# EAGLE design ADC Board-NC (EAGLE 6.4)

## Sheet 1 of 5: Power
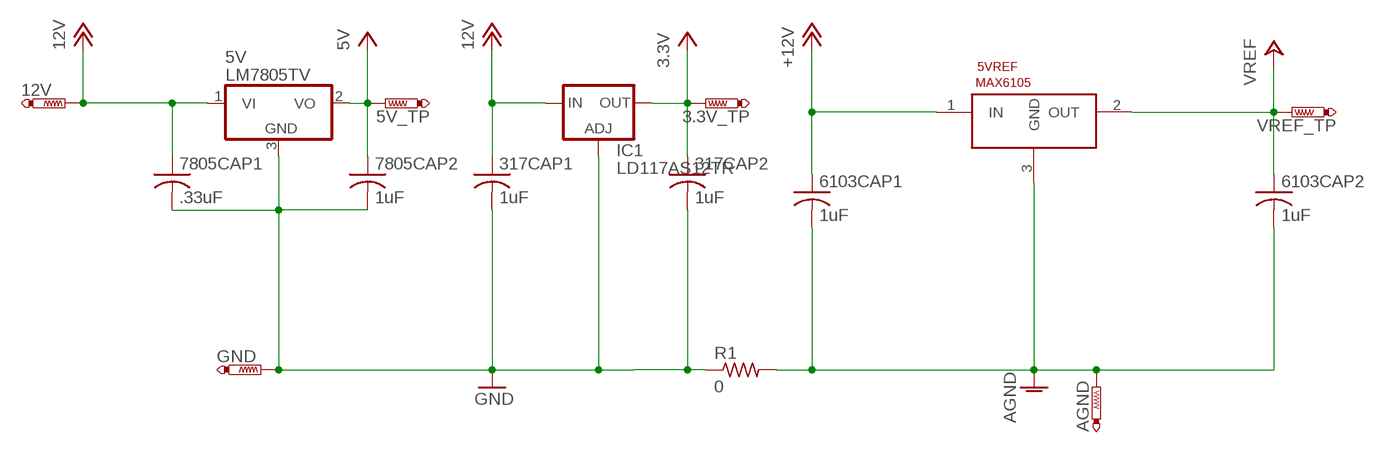
[diagram p0: schematic, sheet 1]

### Parts
3.3V_TP  TESTPAD-20MIL  [20MIL]
5V  LM7805TV  7805DT  [TO252]
5V_TP  TESTPAD-20MIL  [20MIL]
5VREF  MAX6105  MAX6103  [SOT23]
12V  TESTPAD-20MIL  [20MIL]
317CAP1  1uF  C-USC1206  [C1206]
317CAP2  1uF  C-USC1206  [C1206]
6103CAP1  1uF  C-USC1206  [C1206]
6103CAP2  1uF  C-USC1206  [C1206]
7805CAP1  .33uF  C-USC1206  [C1206]
7805CAP2  1uF  C-USC1206  [C1206]
AGND  TESTPAD-20MIL  [20MIL]
GND  TESTPAD-20MIL  [20MIL]
IC1  LD117AS12TR  [SOT223]
R1  0  R-US_R1206  [R1206]
VREF_TP  TESTPAD-20MIL  [20MIL]

### Nets
3.3V: 3.3V_TP.P$1(TP) 317CAP2.1 IC1.4(OUT)
5V: 5V.2(VO) 5V_TP.P$1(TP) 7805CAP2.1 ; also sheet 2
12V: 5V.1(VI) 5VREF.1(IN) 12V.P$1(TP) 317CAP1.1 6103CAP1.1 7805CAP1.1 IC1.3(IN) ; supply symbol labelled +12V ; also sheet 3,5
AGND: 5VREF.3(GND) 6103CAP1.2 6103CAP2.2 AGND.P$1(TP) R1.2 ; also sheet 2,3,4,5
GND: 5V.3(GND) 317CAP1.2 317CAP2.2 7805CAP1.2 7805CAP2.2 GND.P$1(TP) IC1.1(ADJ) R1.1 ; also sheet 2,5
VREF: 5VREF.2(OUT) 6103CAP2.1 VREF_TP.P$1(TP) ; supply symbol labelled Vref ; also sheet 2,4,5

## Sheet 2 of 5: ADCs
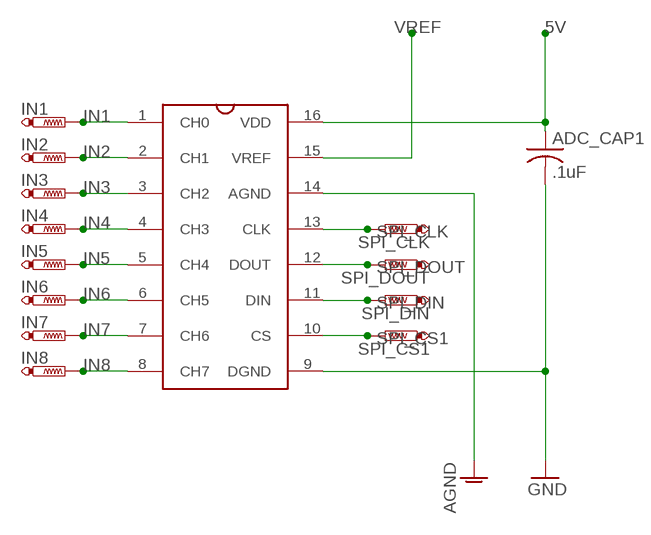
[diagram p1: schematic, sheet 2]

### Parts
ADC1  MCP-3008  [SO16]
ADC_CAP1  .1uF  C-USC1206  [C1206]
IN1  TESTPAD-20MIL  [20MIL]
IN2  TESTPAD-20MIL  [20MIL]
IN3  TESTPAD-20MIL  [20MIL]
IN4  TESTPAD-20MIL  [20MIL]
IN5  TESTPAD-20MIL  [20MIL]
IN6  TESTPAD-20MIL  [20MIL]
IN7  TESTPAD-20MIL  [20MIL]
IN8  TESTPAD-20MIL  [20MIL]
SPI_CLK  TESTPAD-20MIL  [20MIL]
SPI_CS1  TESTPAD-20MIL  [20MIL]
SPI_DIN  TESTPAD-20MIL  [20MIL]
SPI_DOUT  TESTPAD-20MIL  [20MIL]

### Nets
5V: ADC1.16(VDD) ADC_CAP1.1 ; also sheet 1
AGND: ADC1.14(AGND) ; also sheet 1,3,4,5
GND: ADC1.9(DGND) ADC_CAP1.2 ; also sheet 1,5
IN1: ADC1.1(CH0) IN1.P$1(TP) ; also sheet 4,5
IN2: ADC1.2(CH1) IN2.P$1(TP) ; also sheet 4,5
IN3: ADC1.3(CH2) IN3.P$1(TP) ; also sheet 4,5
IN4: ADC1.4(CH3) IN4.P$1(TP) ; also sheet 4,5
IN5: ADC1.5(CH4) IN5.P$1(TP) ; also sheet 4,5
IN6: ADC1.6(CH5) IN6.P$1(TP) ; also sheet 4,5
IN7: ADC1.7(CH6) IN7.P$1(TP) ; also sheet 4,5
IN8: ADC1.8(CH7) IN8.P$1(TP) ; also sheet 3,4
SPI_CLK: ADC1.13(CLK) SPI_CLK.P$1(TP) ; also sheet 5
SPI_CS1: ADC1.10(CS) SPI_CS1.P$1(TP) ; also sheet 5
SPI_DIN: ADC1.11(DIN) SPI_DIN.P$1(TP) ; also sheet 5
SPI_DOUT: ADC1.12(DOUT) SPI_DOUT.P$1(TP) ; also sheet 5
VREF: ADC1.15(VREF) ; also sheet 1,4,5

## Sheet 3 of 5: Temp Sensor
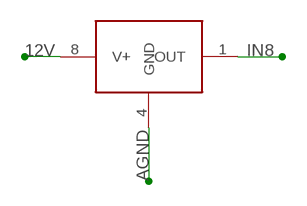
[diagram p2: schematic, sheet 3]

### Parts
U$2  LM35  [SO-08]

### Nets
12V: U$2.8(V+) ; also sheet 1,5
AGND: U$2.4(GND) ; also sheet 1,2,4,5
IN8: U$2.1(OUT) ; also sheet 2,4

## Sheet 4 of 5: Input Protection
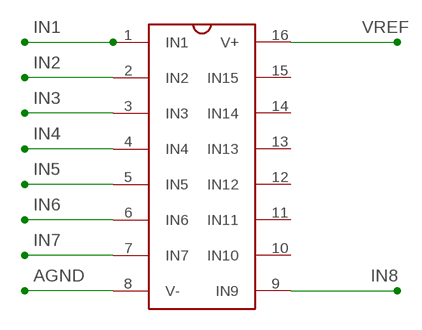
[diagram p3: schematic, sheet 4]

### Parts
U$6  SP720APP  [SO16]

### Nets
AGND: U$6.8(V-) ; also sheet 1,2,3,5
IN1: U$6.1(IN1) ; also sheet 2,5
IN2: U$6.2(IN2) ; also sheet 2,5
IN3: U$6.3(IN3) ; also sheet 2,5
IN4: U$6.4(IN4) ; also sheet 2,5
IN5: U$6.5(IN5) ; also sheet 2,5
IN6: U$6.6(IN6) ; also sheet 2,5
IN7: U$6.7(IN7) ; also sheet 2,5
IN8: U$6.9(IN9) ; also sheet 2,3
VREF: U$6.16(V+) ; also sheet 1,2,5
Unconnected: U$6.10(IN10) U$6.11(IN11) U$6.12(IN12) U$6.13(IN13) U$6.14(IN14) U$6.15(IN15)

## Sheet 5 of 5: Connectors
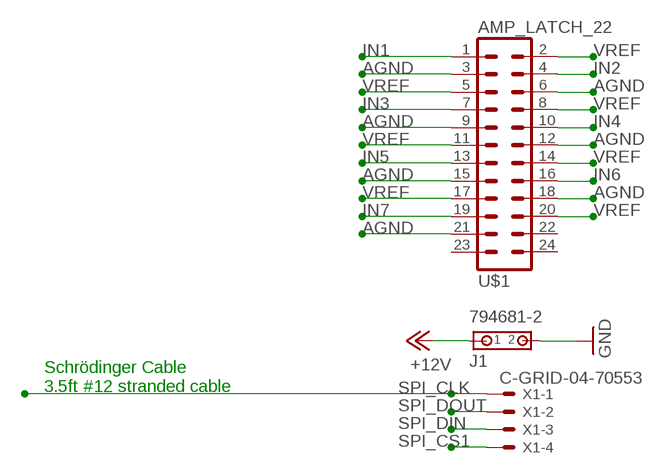
[diagram p4: schematic, sheet 5]

### Parts
J1  794681-2  [794681-2]
U$1  AMP_LATCH_22  [MA22-2]
X1  C-GRID-04-70553  [70553-04]

### Nets
12V: J1.1 ; supply symbol labelled +12V ; also sheet 1,3
AGND: U$1.3 U$1.6 U$1.9 U$1.12 U$1.15 U$1.18 U$1.21 ; also sheet 1,2,3,4
GND: J1.2 ; also sheet 1,2
IN1: U$1.1 ; also sheet 2,4
IN2: U$1.4 ; also sheet 2,4
IN3: U$1.7 ; also sheet 2,4
IN4: U$1.10 ; also sheet 2,4
IN5: U$1.13 ; also sheet 2,4
IN6: U$1.16 ; also sheet 2,4
IN7: U$1.19 ; also sheet 2,4
SPI_CLK: X1.1 ; also sheet 2
SPI_CS1: X1.4 ; also sheet 2
SPI_DIN: X1.3 ; also sheet 2
SPI_DOUT: X1.2 ; also sheet 2
VREF: U$1.2 U$1.5 U$1.8 U$1.11 U$1.14 U$1.17 U$1.20 ; also sheet 1,2,4
Unconnected: U$1.22 U$1.23 U$1.24

### Notes on the sheet
- Schrödinger Cable
  3.5ft #12 stranded cable

## Library data of the parts
3.3V_TP 5V_TP 12V AGND GND IN1-IN8 SPI_CLK SPI_CS1 SPI_DIN SPI_DOUT VREF_TP = LTC6803:TESTPAD-20MIL
5V = linear:78*: Positive VOLTAGE REGULATOR Source: http://cache.national.com/ds/LM/LM78L05.pdf http://www.fairchildsemi.com/ds/LM/LM7805.pdf
5VREF = SolarJacketsADC:MAX6103
317CAP1 317CAP2 6103CAP1 6103CAP2 7805CAP1 7805CAP2 ADC_CAP1 = rcl:C-US: CAPACITOR, American symbol
ADC1 = SolarJacketsADC:MCP-3008
IC1 = v-reg:LD117A?*: Low drop fixed and adjustable positive voltage regulators 1 A Source: http://www.st.com/stonline/products/literature/ds/7194/ld1117axx.pdf
J1 = con-amp:794681-2: Micro MATE-N-LOK Connectors grid 1.5mm Dual Row Through Hole Vertical Metal Through Hole Holddowns Source: ENG_CD_794681_E.pdf
R1 = rcl:R-US_: RESISTOR, American symbol
U$1 = SolarJackets_Common:AMP_LATCH_22
U$2 = SolarJacketsADC:LM35
U$6 = SolarJacketsADC:SP720APP
X1 = con-molex:C-GRID-04: CONNECTOR wire to board 2.54 mm (0.100") pitch header; OC_FARNELL: unknown; OC_NEWARK: unknown

## Board
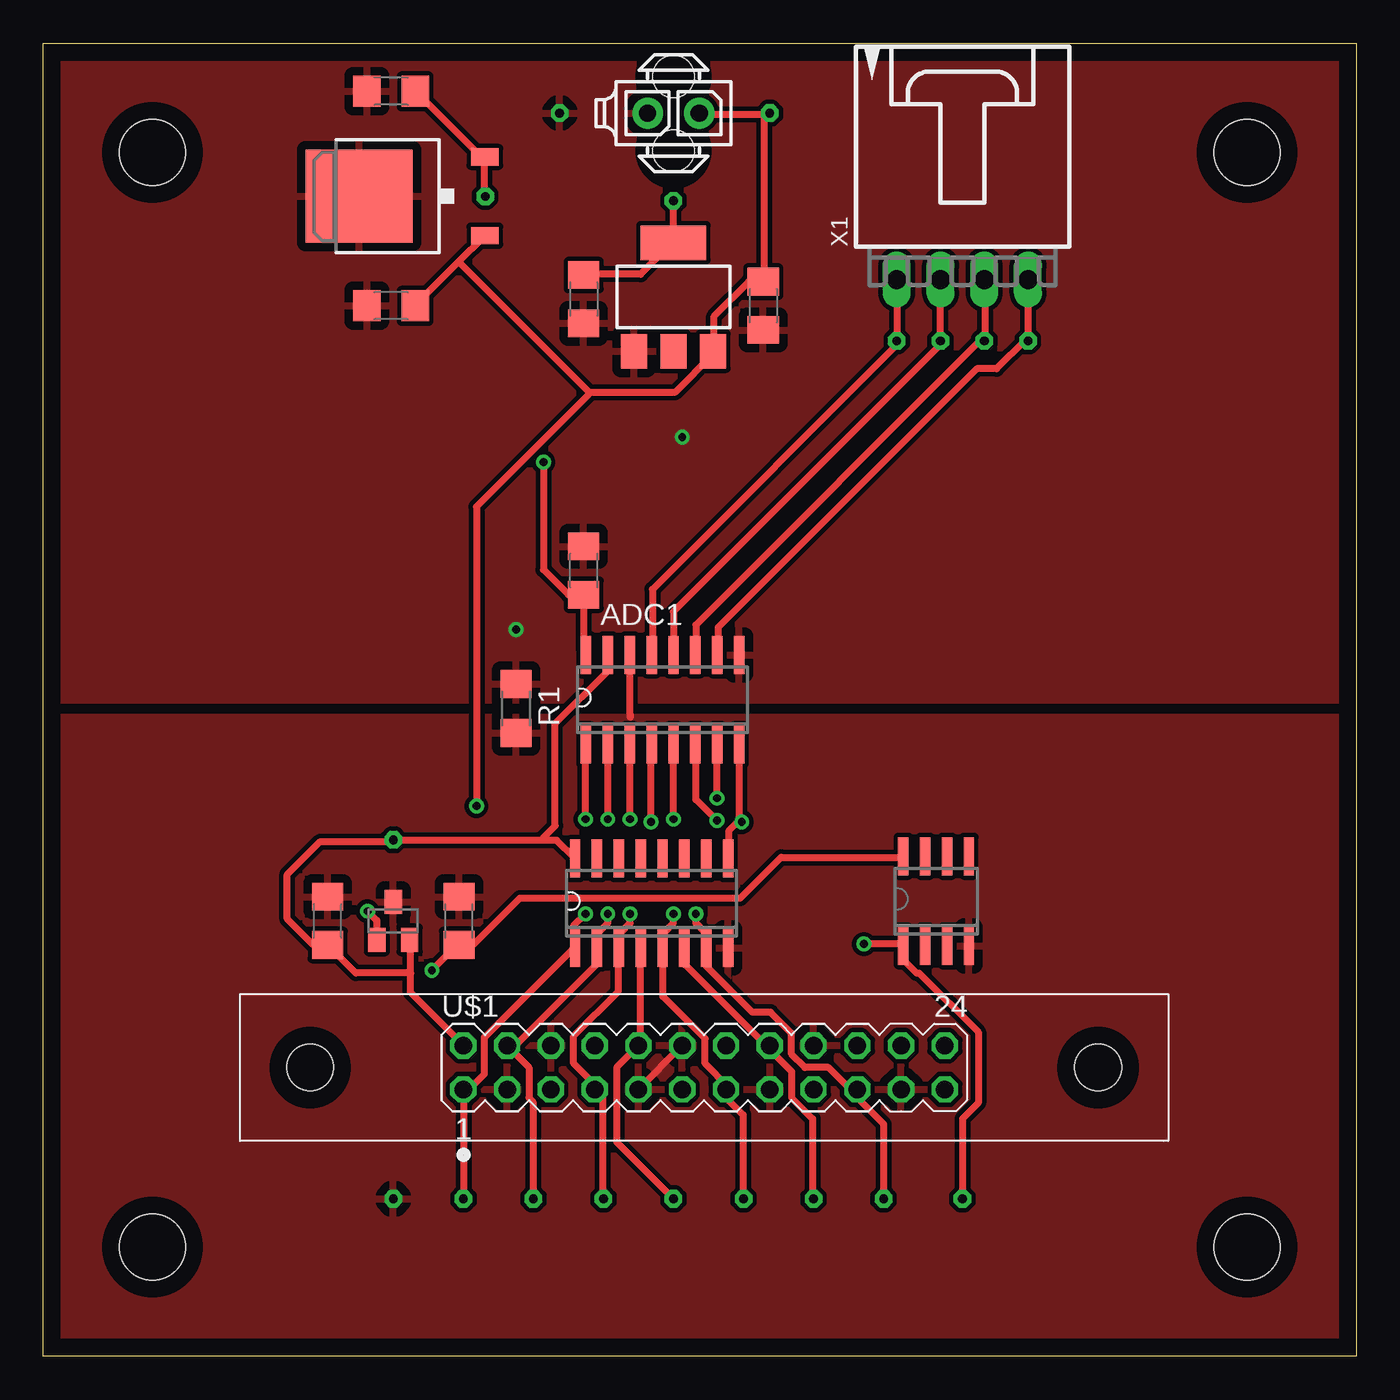
[diagram p5: board, top side]
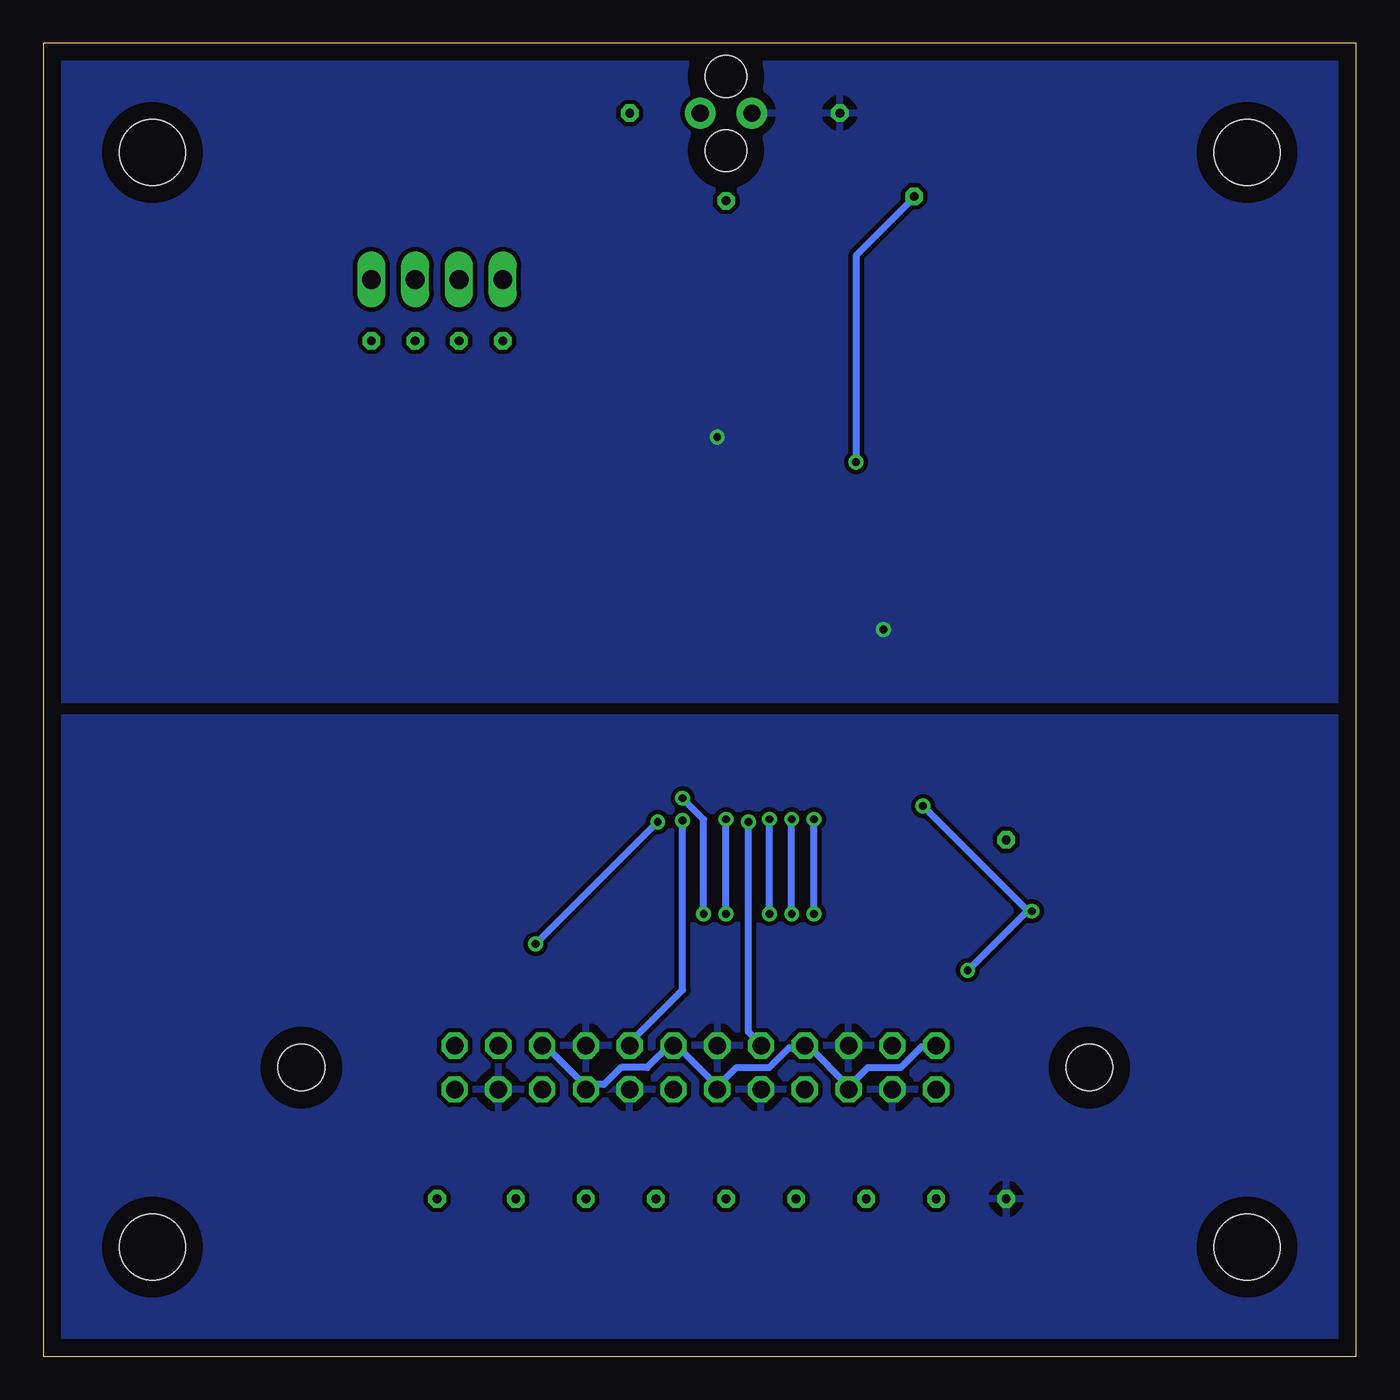
[diagram p6: board, bottom side, seen from below]

Size 76.2 x 76.2 mm. Coordinates in mm from the lower left corner, seen from the top.
Outline: 0,0 0,76.2 76.2,76.2 76.2,0 0,0
Copper layers (1*16): Top 0.035mm / dielectric 1.5mm / Bottom 0.035mm
Design rules "SJ Design Rules *": minimum track width 16mil, minimum drill 18mil, track to track 10mil, track to pad 10mil, pad to pad 10mil, via to via 10mil, smd to smd 10mil, copper to edge 40mil, drill to drill 10mil, minimum pad ring 10mil, minimum via ring 8mil, stop-mask expansion 4mil, vias tented up to drill 0mil, thermal gap 20mil
Holes 3.81 mm at 69.85,69.85 6.35,69.85 69.85,6.35 6.35,6.35

### Footprints (pad centres in the part's own frame; a part is rotated, then mirrored left to right if it is on the bottom)
20MIL = drill 0.508 octagon: P$1 0,0
TO252 = smd 1 x 1.6: 1 -2.28,-4.8; 2 2.28,-4.8 | smd 5.4 x 6.2: 3 0,2.5
SOT23 = smd 1 x 1.4: 1 -0.95,-1.1; 2 0.95,-1.1; 3 0,1.1
C1206 = smd 1.6 x 1.8: 1 -1.4,0; 2 1.4,0
SO16 = smd 0.6 x 2.2: 1 -4.445,-2.6; 2 -3.175,-2.6; 3 -1.905,-2.6; 4 -0.635,-2.6; 5 0.635,-2.6; 6 1.905,-2.6; 7 3.175,-2.6; 8 4.445,-2.6; 9 4.445,2.6; 10 3.175,2.6; 11 1.905,2.6; 12 0.635,2.6; 13 -0.635,2.6; 14 -1.905,2.6; 15 -3.175,2.6; 16 -4.445,2.6
SOT223 = smd 1.5 x 2: 1 -2.3,-3.15; 2 0,-3.15; 3 2.3,-3.15 | smd 3.8 x 2: 4 0,3.15
794681-2 = drill 1 pad 1.778: 1 0,-1.5; 2 0,1.5 | hole 2.4: 2.13,0; -2.17,0
R1206 = smd 1.6 x 1.803: 1 -1.422,0; 2 1.422,0
MA22-2 = drill 1.016 octagon: 1 -11.43,-1.27; 2 -11.43,1.27; 3 -8.89,-1.27; 4 -8.89,1.27; 5 -6.35,-1.27; 6 -6.35,1.27; 7 -3.81,-1.27; 8 -3.81,1.27; 9 -1.27,-1.27; 10 -1.27,1.27; 11 1.27,-1.27; 12 1.27,1.27; 13 3.81,-1.27; 14 3.81,1.27; 15 6.35,-1.27; 16 6.35,1.27; 17 8.89,-1.27; 18 8.89,1.27; 19 11.43,-1.27; 20 11.43,1.27; 21 13.97,-1.27; 22 13.97,1.27; 23 16.51,-1.27; 24 16.51,1.27 | hole 2.692: -20.32,0; 25.4,0
SO-08 = smd 0.6 x 2.2: 1 -1.905,-2.6; 2 -0.635,-2.6; 3 0.635,-2.6; 4 1.905,-2.6; 5 1.905,2.6; 6 0.635,2.6; 7 -0.635,2.6; 8 -1.905,2.6
70553-04 = drill 1.092 long: 1 -3.81,-7.62; 2 -1.27,-7.62; 3 1.27,-7.62; 4 3.81,-7.62

### Placement (x,y rotation side)
3.3V_TP  36.58,67.06 0 top
5V  20.83,67.31 90 top
5V_TP  25.65,67.31 0 top
5VREF  20.32,25.27 0 top
12V  42.16,72.14 0 top
317CAP1  41.78,60.96 270 top
317CAP2  31.37,61.34 270 top
6103CAP1  24.13,25.27 90 top
6103CAP2  16.51,25.27 90 top
7805CAP1  20.19,60.96 180 top
7805CAP2  20.19,73.41 180 top
ADC1  35.94,38.1 0 top
ADC_CAP1  31.37,45.59 90 top
AGND  20.32,9.14 0 top
GND  29.97,72.14 0 top
IC1  36.58,61.47 0 top
IN1  24.38,9.14 0 top
IN2  28.45,9.14 0 top
IN3  32.51,9.14 0 top
IN4  36.58,9.14 0 top
IN5  40.64,9.14 0 top
IN6  44.7,9.14 0 top
IN7  48.77,9.14 0 top
IN8  53.34,9.14 0 top
J1  36.58,72.14 90 top
R1  27.43,37.59 270 top
SPI_CLK  49.53,58.93 0 top
SPI_CS1  57.15,58.93 0 top
SPI_DIN  54.61,58.93 0 top
SPI_DOUT  52.07,58.93 0 top
U$1  35.81,16.76 0 top
U$2  51.82,26.42 0 top
U$6  35.31,26.29 0 top
VREF_TP  20.32,29.97 0 top
X1  53.34,70.1 0 top

### Tracks (layer width: path | path; a pad name or v marks a point on that pad's centre or on a via)
3.3V
  Top 0.406: 317CAP2.1 31.39,62.79 34.67,62.79 36.58,64.69 IC1.4 36.58,64.85 3.3V_TP.P$1
5V  (via drill 0.46)
  Top 0.406: ADC1.16 31.55,40.77 31.39,40.92 31.39,44.12 ADC_CAP1.1 31.17,44.2 30.48,44.2 29.03,45.64 v29.03,51.89 | 5V_TP.P$1 25.6,67.36 25.6,69.57 5V.2 25.45,69.57 21.64,73.38 7805CAP2.1
  Bottom 0.406: v29.03,51.89 29.03,63.86 25.6,67.28 5V_TP.P$1
12V  (via drill 0.46)
  Top 0.406: v18.82,25.83 19.36,25.3 19.36,24.23 5VREF.1 | v22.55,22.4 24.08,23.93 6103CAP1.1 24.31,23.93 24.99,23.93 27.66,26.59 40.46,26.59 42.82,28.96 49.91,28.96 U$2.8 | 24.12,63.51 21.57,60.96 7805CAP1.1 | 24.12,63.51 25.6,65 5V.1 | J1.1 38.1,72.08 42.14,72.08 12V.P$1 41.83,71.93 41.83,62.56 317CAP1.1 41.76,62.33 40.92,62.33 38.94,60.35 38.94,58.37 IC1.3 38.86,58.14 36.65,55.93 31.7,55.93 | 31.7,55.93 24.23,63.4 24.12,63.51 | v25.15,31.93 25.15,49.3 31.62,55.78 31.7,55.93
  Bottom 0.406: v22.55,22.4 19.13,25.83 v18.82,25.83 19.2,25.98 v25.15,31.93
AGND
  Top 0.406: ADC1.14 34.06,40.69 34.06,37.26 34.06,37.08 | U$1.9 U$1.12
  pour Bottom: 0.51,37.08 0.51,0.51 75.69,0.51 75.69,37.08
  pour Top: 0.51,37.08 0.51,0.51 75.69,0.51 75.69,37.08
GND  (via drill 0.46)
  other vias: 27.43,42.16 37.08,53.34
  pour Top: 0.51,75.69 0.51,38.1 75.69,38.1 75.69,75.69
  pour Bottom: 0.51,75.69 0.51,38.1 75.69,38.1 75.69,75.69
IN1  (via drill 0.46)
  Top 0.406: IN1.P$1 24.38,15.47 U$1.1 24.54,15.32 25.6,16.38 25.6,18.52 30.71,23.62 30.86,23.62 U$6.1 30.79,23.85 30.79,24.99 v31.47,25.68 | v31.47,31.17 31.47,35.43 ADC1.1
  Bottom 0.406: v31.47,25.68 v31.47,31.17
IN2  (via drill 0.46)
  Top 0.406: IN2.P$1 28.42,9.14 28.42,14.78 28.19,15.01 28.19,16.76 26.98,17.98 U$1.4 27.28,17.91 32.08,22.71 32.08,23.62 U$6.2 32.23,23.85 32.23,24.61 32.77,25.15 v32.77,25.68 | v32.77,31.17 32.77,35.43 ADC1.2
  Bottom 0.406: v32.77,25.68 v32.77,31.17
IN3  (via drill 0.46)
  Top 0.406: IN3.P$1 32.46,9.14 32.46,15.01 32,15.47 U$1.7 32.16,15.62 30.79,16.99 30.79,18.59 33.38,21.18 33.38,23.62 U$6.3 33.53,23.85 33.53,24.61 34.06,25.15 v34.06,25.68 | v34.06,31.17 34.06,35.43 ADC1.3
  Bottom 0.406: v34.06,25.68 v34.06,31.17
IN4  (via drill 0.46)
  Top 0.406: U$6.4 34.67,23.62 34.67,18.14 U$1.10 33.27,16.76 33.27,12.45 IN4.P$1 | v35.28,31.01 35.28,35.43 ADC1.4
  Bottom 0.406: v35.28,31.01 35.28,18.82 34.52,18.06 U$1.10
IN5  (via drill 0.46)
  Top 0.406: IN5.P$1 40.62,9.14 40.62,14.02 39.62,15.01 39.62,15.47 U$1.13 39.78,15.62 38.41,16.99 38.41,18.44 35.97,20.88 35.97,23.62 U$6.5 36.04,23.85 36.04,24.61 36.58,25.15 v36.58,25.68 | v36.58,31.17 36.58,35.43 ADC1.5
  Bottom 0.406: v36.58,25.68 v36.58,31.17
IN6  (via drill 0.46)
  Top 0.406: IN6.P$1 44.65,9.14 44.65,13.79 43.43,15.01 43.43,16.54 42.22,17.75 42.22,17.98 U$1.16 41.99,17.98 37.26,22.71 37.26,23.62 U$6.6 | v39.09,31.09 37.87,32.31 37.87,35.43 ADC1.6
  Bottom 0.406: v39.09,31.09 39.09,21.26 42.14,18.21 42.14,18.06 U$1.16
IN7  (via drill 0.46)
  Top 0.406: IN7.P$1 48.77,13.49 47.24,15.01 47.24,15.47 U$1.19 47.09,15.24 45.57,16.76 44.2,16.76 43.43,17.53 43.43,18.75 42.22,19.96 41.15,19.96 38.48,22.63 38.48,23.62 U$6.7 38.41,23.85 38.41,24.61 37.87,25.15 v37.87,25.68 | v39.09,32.38 39.09,35.43 ADC1.7
  Bottom 0.406: v39.09,32.38 37.87,31.17 v37.87,25.68
IN8  (via drill 0.46)
  Top 0.406: 40.39,31.09 39.78,30.48 39.78,28.96 U$6.9 | 40.39,31.09 40.39,35.43 ADC1.8 | IN8.P$1 53.34,13.79 54.25,14.71 54.25,18.82 50.83,22.25 50.67,22.25 49.91,23.01 49.91,23.77 U$2.1 49.76,23.93 v47.62,23.93 | v40.54,31.01 40.39,31.09
  Bottom 0.406: v47.62,23.93 v40.54,31.01
SPI_CLK
  Top 0.406: X1.1 49.53,58.98 SPI_CLK.P$1 49.61,58.75 35.36,44.5 35.36,40.77 ADC1.13
SPI_CS1
  Top 0.406: X1.4 57.15,58.98 SPI_CS1.P$1 57,58.98 55.32,57.3 54.18,57.3 39.17,42.29 39.17,40.77 ADC1.10
SPI_DIN
  Top 0.406: X1.3 54.63,62.48 54.63,58.98 SPI_DIN.P$1 54.48,59.05 37.87,42.44 37.87,40.77 ADC1.11
SPI_DOUT
  Top 0.406: X1.2 52.05,62.48 52.05,58.98 SPI_DOUT.P$1 52.12,58.75 36.58,43.2 36.58,40.77 ADC1.12
VREF
  Top 0.406: 29.03,29.95 29.79,29.95 U$6.16 | 29.03,29.95 20.34,29.95 VREF_TP.P$1 20.19,29.87 16.08,29.87 14.17,27.96 14.17,25.38 15.62,23.93 16.31,23.93 6103CAP2.1 16.54,23.85 18.14,22.25 21.18,22.25 21.34,22.25 | ADC1.15 32.77,39.78 29.72,36.73 29.72,30.79 29.03,30.1 29.03,29.95 | 21.34,22.25 21.34,21.11 24.38,18.06 U$1.2 | 21.34,22.25 21.34,24.16 5VREF.2
  Bottom 0.406: U$1.20 47.24,17.98 47.02,17.98 44.73,15.7 44.73,15.54 U$1.17 44.58,15.77 43.66,15.77 42.67,16.76 41.15,16.76 39.78,18.14 U$1.14 39.62,17.98 39.4,17.98 37.11,15.7 37.11,15.54 U$1.11 36.96,15.77 35.97,16.76 34.06,16.76 32.92,17.91 32.16,17.91 U$1.8 32,17.98 31.77,17.98 29.49,15.7 29.49,15.54 U$1.5 29.34,15.77 28.35,16.76 26.44,16.76 25.22,17.98 24.38,17.98 U$1.2

### Text on the board
tValues: GND | 12V | CLK / DOUT / DIN / CS | Analog Digital Converter | AGND / / IN1 / / IN2 / / IN3 / / IN4 / / IN5 / / IN6 / / IN7 / / IN8
bValues: REV 4 4/22/2013